# Altium schematic sheet TAXM8M4RDBCCT2T1_TAXM8M4RDBCCT2T.schdoc
size 127 x 99 mm
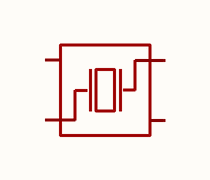
[diagram p0: TAXM8M4RDBCCT2T1_TAXM8M4RDBCCT2T.schdoc]

## Parts
X?  8MHz  [CRYSTAL-SMD_4P-L3.2-W2.5-BL]  (value not drawn)

## Nets

Not connected (* = marked no-connect by the designer): X? 1 2 3 4

## Library data of the parts
X? = TAXM8M4RDBCCT2T: Manufacturer: YJX(雅晶鑫); Add into BOM: yes; Normal temperature Frequency Tolerance: ±10ppm; Load Capacitance: 10pF; Frequency Stability: ±15ppm; Equivalent Series Resistance(ESR): 250Ω; Symbol: TAXM8M4RDBCCT2T; Device: TAXM8M4RDBCCT2T; LCSC Part Name: 8MHz ±10ppm 10pF; Supplier Part: C400090; Manufacturer Part: TAXM8M4RDBCCT2T; Supplier Footprint: SMD3225-4P; JLCPCB Part Class: Extended Part; Datasheet: https://item.szlcsc.com/datasheet/TAXM8M4RDBCCT2T/383475.html; Supplier: LCSC; Convert to PCB: yes; Type: 贴片晶振; Value: 8MHz; Operating Temperature: -40℃~+85℃